# Altium schematic sheet accumulator.SchDoc
size A4; SheetNumber: 1; SheetTotal: 1
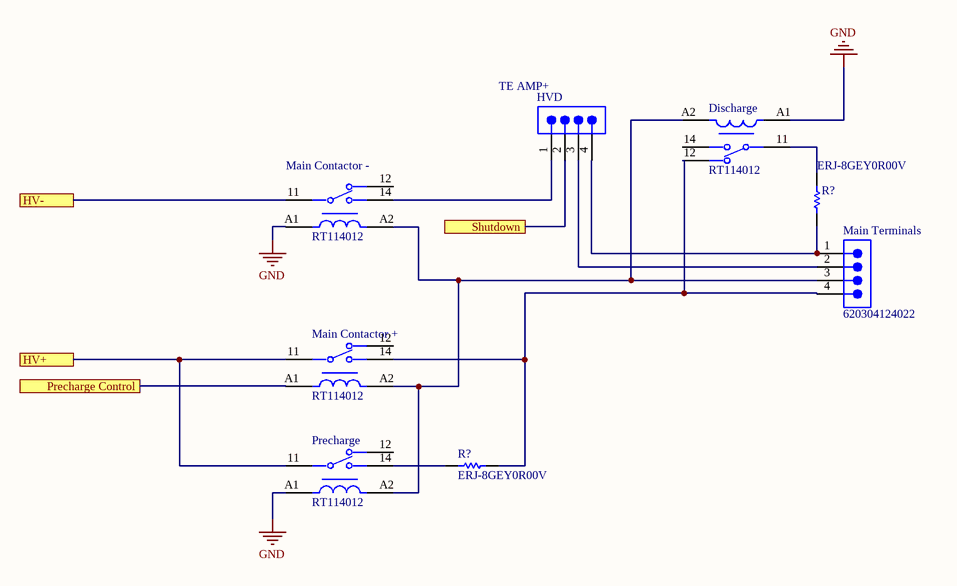
[diagram p0: accumulator.SchDoc]

## Parts
(Parts that share a designator on the sheet are numbered #1, #2 ... from top to bottom, then left to right.)
Discharge  RT114012  [FP-RT114012-MFG]
HVD  TE AMP+  [620304124022]
Main_Contactor_+  RT114012  [FP-RT114012-MFG]
Main_Contactor_-  RT114012  [FP-RT114012-MFG]
Main_Terminals  620304124022  [620304124022]
Precharge  RT114012  [FP-RT114012-MFG]
R?#1  ERJ-8GEY0R00V  [RESC3216X70X50NL05T20]
R?#2  ERJ-8GEY0R00V  [RESC3216X70X50NL05T20]

## Ports
HV+, HV-, Precharge Control, Shutdown

## Nets
GND: Discharge.A1 Main_Contactor_-.A1 Precharge.A1
HV+: Main_Contactor_+.11 Precharge.11 ; port HV+
HV-: Main_Contactor_-.11 ; port HV-
Precharge Control: Main_Contactor_+.A1 ; port Precharge Control
Shutdown: HVD.2 ; port Shutdown
NetDischarge_11: Discharge.11 R?#1.1
NetDischarge_12: Discharge.12 Main_Contactor_+.14 Main_Terminals.4 R?#2.2
NetDischarge_A2: Discharge.A2 Main_Contactor_+.A2 Main_Contactor_-.A2 Main_Terminals.3 Precharge.A2
NetHVD_1: HVD.1 Main_Contactor_-.14
NetHVD_3: HVD.3 Main_Terminals.2
NetHVD_4: HVD.4 Main_Terminals.1 R?#1.2
NetPrecharge_14: Precharge.14 R?#2.1

Not connected (* = marked no-connect by the designer): Discharge 14; Main_Contactor_+ 12; Main_Contactor_- 12; Precharge 12

## Library data of the parts
Discharge Main_Contactor_+ Main_Contactor_- Precharge = CMP-03395-000068-1: RELAY GEN PURPOSE SPDT 12A 12V; Manufacturer: TE Connectivity; Coil Power: 400mW; Coil Resistance: 360Ω; Coil Type: Non-Latching; Number Of Contacts: 1; Height: 15.7mm; Throw Configuration: SPDT; Mouser Description: General Purpose Relays RT114012; Device Class L1: Electromechanical; ComponentLink2URL: https://www.te.com/commerce/DocumentDelivery/DDEController?Action=showdoc&DocId=Data+Sheet%7FRT1%7F0219%7Fpdf%7FEnglish%7FENG_DS_RT1_0219.pdf%7F1419108-1; Digikey Description: RELAY GEN PURPOSE SPDT 12A 12V; Package: RT114012; RoHS: TRUE; ComponentLink2Description: Datasheet; Octopart: https://octopart.com/rt114012-te+connectivity-39636422; Device Class L2: Relays; Manufacturer Part Number: RT114012; Ambient Temperature Range High: +85°C; Ambient Temperature Range Low: -40°C; Coil Voltage: 12V; Current Rating: 12A; Category: Relay; Lead Free: Yes; Device Class L3: Power Relays; Automotive: No
HVD Main_Terminals = CMP-1502-00662-2: NexarPartId: 18818244; Insulation: Insulated; Number of Contacts: 4; Connector Type: Male Pin; Contact Resistance: 20mΩ; Current Rating: 2A; Insulation Resistance: 1GΩ; Operating Supply Voltage: 100V; Pitch: 2mm; Voltage Rating: 125V; Gender: Male; Packaging: Tape and Reel; Number of Rows: 1; Height: 6.6mm; Width: 11.9mm; Number of Pins: 4; Contact Plating: Tin; Contact Mating Length: 3.5052mm; Flammability Rating: UL94 V-0; Color: Beige, White; Contact Gender: Male; Orientation: Vertical; Contact Material: Copper; Max Operating Temperature: 85°C; RoHS: Compliant; Number of Positions: 4; Lead Pitch: 2mm; Min Operating Temperature: -40°C; Length: 9mm; Termination: SMD/SMT; Housing Material: Nylon; REACH SVHC: Unknown; Lead Free: Lead Free; Mount: Surface Mount
R?#1 R?#2 = CMP-2003-00541-1: Manufacturer: Panasonic; Part Number: ERJ-8GEY0R00V